# EasyEDA Pro project fm33fk5410_Topaz_v1.2.epro, board PCB7
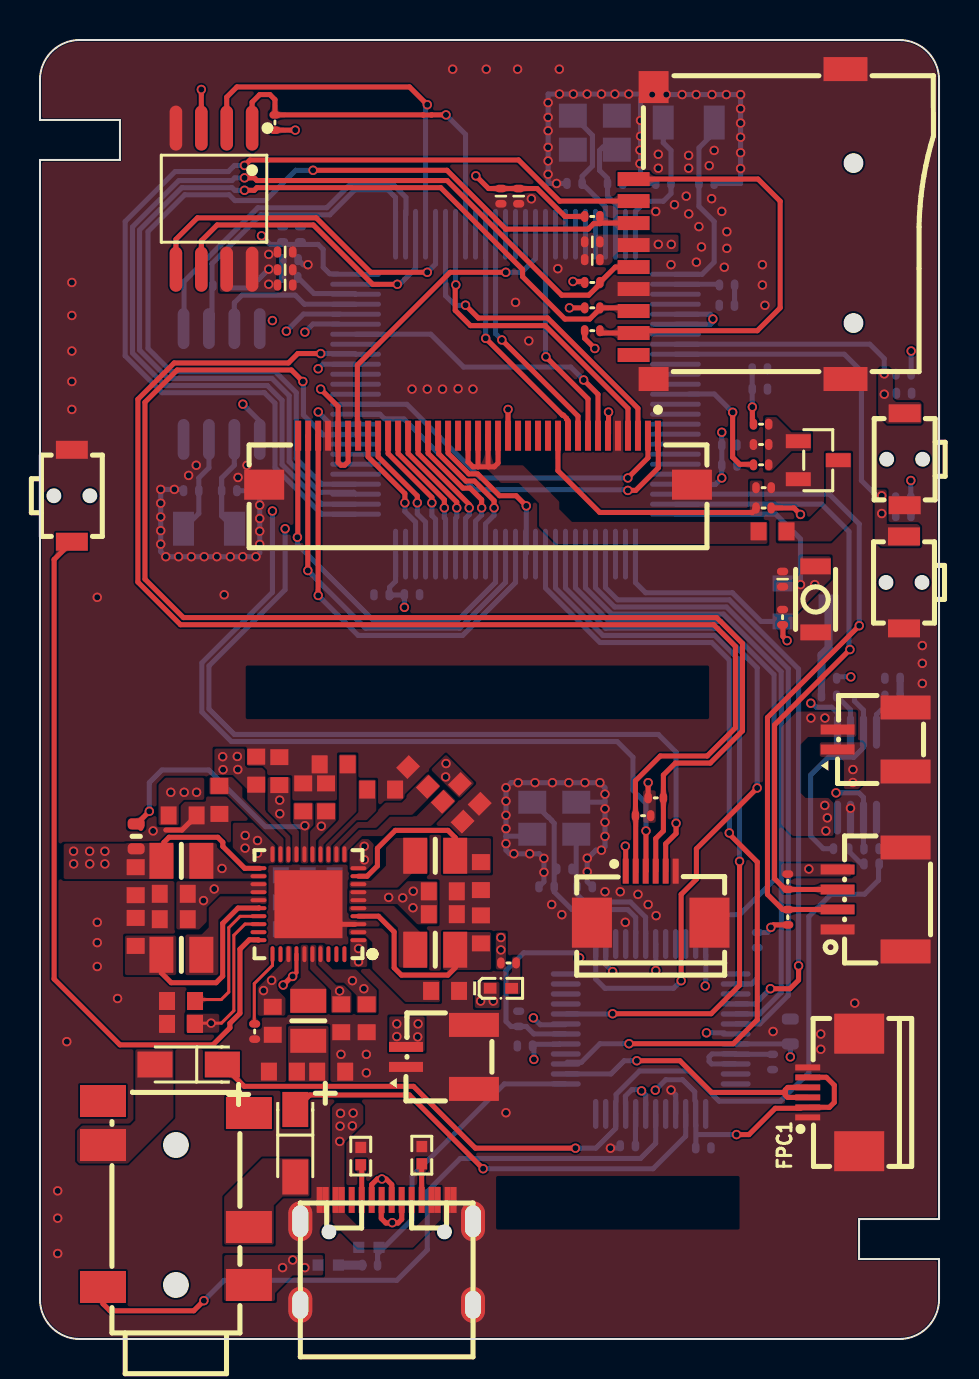
[diagram p3: board, top side]
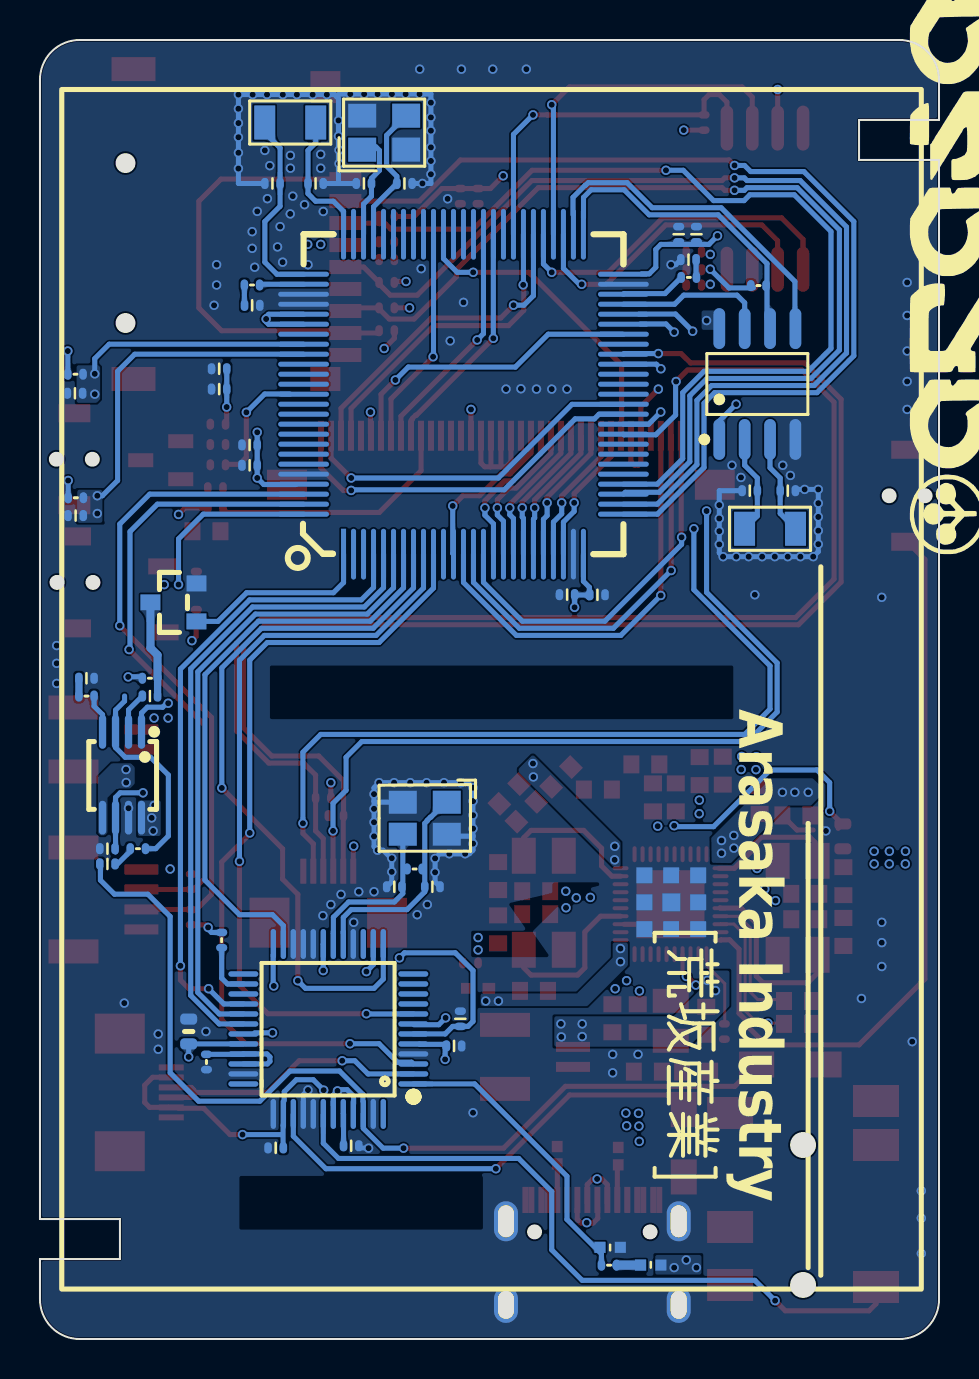
[diagram p4: board, bottom side, seen from below]

Outline 44.98 x 64.97 mm; copper layers: Top Layer, Inner1, Inner2, Bottom Layer. Coordinates in mm from the lower left corner of the outline.
Outline path: 0,62.99 0,60.97 4,60.97 4,58.97 0,58.97 0,1.99 arc(0.58,0.58) 1.99,0 42.99,0 arc(44.39,0.58) 44.98,1.99 44.98,4 40.98,4 40.98,6 44.98,6 44.98,62.99 arc(44.39,64.39) 42.99,64.97 1.99,64.97 arc(0.58,64.39) 0,62.99
Stack: Top Layer 0.035mm 外层铜厚1oz / Dielectric1 0.2104mm 7628 RC49% 8.6mil / Inner1 0.0152mm 内层铜厚 / Dielectric2 1.065mm 1.1mm H/HOZ Copper / Inner2 0.0152mm 内层铜厚 / Dielectric3 0.2104mm 7628 RC49% 8.6mil / Bottom Layer 0.035mm 外层铜厚1oz

## Design rules (mm)
template: 自定义配置
spacing copperThickness1oz (default): track to track 0.102, other pairs 0 to 0.3
spacing copperThickness2oz: track to track 0.203, other pairs 0.152 to 0.3
track width copperThickness1oz (default): min 0.127, default 0.254, max 2.54
track width copperThickness2oz: min 0.203, default 0.254, max 2.54
differential pair differentialPair (default): width min 0.127, default 0.254, max 2.54; gap min 0.152, default 0.152
via viaSize (default): diameter min 0.178, default 0.47, max 10; hole min 0.178, default 0.305, max 6.299

## Placement (name value [footprint] x y rotation side)
C4  12pF  [C0402-NSK]  26.74 57.8 180 bottom
C5  2.2uF  [C0603]  6.69 21 180 top
C6  22uF  [C0603]  22.06 20.49 90 top
C11  2.2uF  [C0603]  21.5 27.26 315 top
C12  2.2uF  [C0603]  20.65 26.37 315 top
C13  2.2uF  [C0603]  7.06 15.76 180 top
C14  2.2uF  [C0603]  7.06 16.91 180 top
C15  10uF  [C0603]  15.07 16.04 270 top
C16  10uF  [C0603]  16.34 16.04 270 top
C17  100nF  [C0603]  14.57 13.37 180 top
C18  22uF  [C0603]  12.15 13.38 0 top
C19  2.2uF  [C0603]  11.64 15.92 90 top
C20  1uF  [C0603]  20.26 17.41 180 top
C21  2.2uF  [C0603]  11.97 28.4 270 top
C22  2.2uF  [C0603]  10.82 28.43 270 top
C23  2.2uF  [C0603]  8.98 26.97 90 top
C24  2.2uF  [C0603]  13.17 27.09 270 top
C25  2.2uF  [C0603]  14.31 27.09 270 top
C26  4.7uF  [C0603]  17.07 27.48 180 top
C27  2.2uF  [C0603]  18.91 28.11 315 top
C28  2.2uF  [C0603]  14.69 28.74 0 top
C34  100nF  [C0402-NSK]  37.15 38.01 270 top
C35  1uF  [C0402-NSK]  34.36 51.7 0 bottom
C36  1uF  [C0402-NSK]  12.53 53.99 180 bottom
C342  100nF  [C0402-NSK]  13.02 55.26 270 bottom
C343  100nF  [C0402-NSK]  27.63 53.99 0 top
C346  100nF  [C0402-NSK]  24.26 14.66 0 bottom
C347  100nF  [C0402-NSK]  23.95 16.02 270 bottom
C348  1uf  [C0402-NSK]  29.41 9.67 180 bottom
C349  10nF  [C0402-NSK]  33.18 9.56 0 bottom
C350  12pF  [C0402-NSK]  25.34 22.62 0 bottom
C351  12pF  [C0402-NSK]  27.25 22.62 180 bottom
C352  10uF  [CAP-SMD_L3.2-W1.6-RD-C7171]  7.44 13.73 180 top
C353  10uF  [CAP-SMD_L3.2-W1.6-RD-C7171]  12.77 9.79 270 top
C358  100nF  [C0402-NSK]  41.6 23.76 180 bottom
C359  100nF  [C0402-NSK]  42.65 33.05 0 bottom
C360  1uF  [C0402-NSK]  39.47 32.16 180 bottom
C361  1uF  [C0402-NSK]  41.6 24.53 180 bottom
C367  100nF  [C0402-NSK]  12.26 54.37 180 top
C368  100nF  [C0402-NSK]  36.01 47.51 180 bottom
C369  100nF  [C0402-NSK]  34.49 44.72 180 bottom
C370  100nF  [C0402-NSK]  17.09 37.23 0 bottom
C371  100nF  [C0402-NSK]  18.61 37.23 180 bottom
C372  10uF  [C0402-NSK]  34.49 43.7 180 bottom
C373  100nF  [C0402-NSK]  36.01 48.53 180 bottom
C374  100nF  [C0402-NSK]  23.95 57.16 90 top
C375  100nF  [C0402-NSK]  12.14 55.26 270 bottom
C376  100nF  [C0402-NSK]  12.26 53.48 180 top
C377  100nF  [C0402-NSK]  12.26 52.72 180 top
C378  12pF  [C0402-NSK]  9.47 42.43 180 bottom
C379  12pF  [C0402-NSK]  7.56 42.43 0 bottom
C383  12pF  [C0402-NSK]  33.34 57.8 0 bottom
C384  12pF  [C0402-NSK]  31.19 57.8 180 bottom
C385  12pF  [C0402-NSK]  28.77 57.8 0 bottom
C391  22uF  [C0603]  4.79 22.9 270 top
C392  22uF  [C0603]  4.79 20.36 90 top
C393  22uF  [C0603]  22.06 23.16 270 top
C394  2.2uF  [C0603]  6.69 22.27 180 top
C395  2.2uF  [C0603]  7.14 26.19 0 top
C396  2.2uF  [C0603]  20.15 21.25 0 top
C397  2.2uF  [C0603]  20.15 22.39 0 top
C398  1uF  [C0603 NSK]  37.54 15.38 270 bottom
C400  10nF  [C0402-NSK#2]  16.45 4.59 0 bottom
C401  1uF  [C0402-NSK#2]  14.42 3.7 180 bottom
C402  1uF  [C0402-NSK]  43.22 47.3 180 bottom
C403  1uF  [C0402-NSK]  43.19 41.19 180 bottom
CARD2  TF-115-BCP9  [TF-SMD_TF-115-BCP9]  35 55.77 90 top
CN2  PJ-342  [AUDIO-SMD_PJ-342]  6.8 7.25 180 top
CN5  WAFER-SH1.0-4PWB  [CONN-SMD_4P-P1.00_WAFER-SH1.0-4PWB]  41.6 21.99 90 top
FPC1  FPC-05F-6PH20  [FPC-SMD_6P-P0.50_XUNPU_FPC-05F-6PH20]  39.69 12.33 90 top
L1  1uH  [L0806]  7.07 23.92 180 top
L2  1uH  [L0806]  7.07 19.22 180 top
L4  1uH  [L0806]  19.77 24.17 0 top
L5  1uH  [L0806]  13.42 15.92 90 top
L8  1uH  [L0806]  19.77 19.47 0 top
lcd1  KH-FG0.5-H2.0-37PIN  [FPC-SMD_37P-P0.50_KINGHELM_KH-FG0.5-H2.0-37PIN]  21.91 43.96 0 top
LED2  NCD0402R1  [LED0402-RD]  23.06 17.54 0 top
NOREF  -  [Pad_e74]  13.4 20.5 180 top
NOREF#2  -  [Pad_e87]  13.39 21.84 180 top
NOREF#3  -  [Pad_e101]  13.4 23.19 180 top
NOREF#4  -  [Pad_e73]  12.05 20.5 180 top
NOREF#5  -  [Pad_e90]  14.74 21.84 180 top
NOREF#6  -  [Pad_e75]  14.74 20.5 180 top
NOREF#7  -  [Pad_e88]  12.05 21.84 180 top
NOREF#8  -  [Pad_e106]  12.05 23.19 0 top
NOREF#9  -  [Pad_e91]  14.74 23.19 0 top
Q1  MMS8050-H-TP  [SOT-23-3_L2.9-W1.3-P1.90-LS2.4-BR]  38.93 43.96 180 top
Q5  AO3401A  [SOT-23_L2.9-W1.3-P1.90-LS2.4-BR]  38.3 36.84 180 bottom
R1  4.7kΩ  [R0402#2]  30.17 26.18 0 top
R2  4.7kΩ  [R0402#2]  30.8 27.07 180 top
R3  0Ω  [R0402#2]  36.2 42.58 0 top
R4  10KΩ  [R0402#2]  10.74 15.38 270 top
R5  4.33Ω  [C0603]  36.65 40.4 180 top
R6  1kΩ  [R0402#2]  36.07 43.73 0 top
R7  10kΩ  [R0402#2]  36.07 44.74 0 top
R8  NC  [R0402#2]  36.07 45.76 0 top
R18  10K  [R0402#2]  37.15 36.1 270 top
R19  47Ω  [R0402#2]  34.37 52.72 180 bottom
R20  47Ω  [R0402#2]  12.52 53.1 0 bottom
R21  4.7kΩ  [R0402#2]  37.41 22.87 90 top
R22  4.7kΩ  [R0402#2]  37.41 21.1 270 top
R23  4.7kΩ  [R0402#2]  27.63 50.43 180 top
R24  4.7kΩ  [R0402#2]  27.63 51.58 180 top
R25  4.7kΩ  [R0402#2]  27.63 52.85 180 top
R26  4.7kΩ  [R0402#2]  27.63 56.15 180 top
R27  100kΩ  [R0402#2]  35.88 19.95 90 bottom
R28  1MΩ  [R0402#2]  26.23 23.51 0 bottom
R29  100kΩ  [R0402#2]  36.65 13.86 90 bottom
R35  30kΩ  [R0402#2]  40.08 24.53 180 bottom
R36  30kΩ  [R0402#2]  42.65 32.16 180 bottom
R37  30kΩ  [R0402#2]  39.47 33.05 0 bottom
R42  10K  [R0402#2]  9.03 52.69 0 bottom
R50  10KΩ  [R0402#2]  23.44 18.81 0 top
R51  0Ω  [C0603 NSK]  4.81 25.14 270 top
R52  NC  [R0402#2]  36.2 41.57 0 top
R55  2kΩ  [R0402#2]  11.75 60.85 90 top
R56  5.1kΩ  [R0402]  19.1 9.19 270 top
R57  5.1kΩ  [R0402]  16.05 9.15 90 top
R58  430Ω  [R0402#2]  16.51 3.69 180 bottom
R59  4.7kΩ  [R0402#2]  43.18 42.08 0 bottom
R60  4.7kΩ  [R0402#2]  43.2 48.26 0 bottom
touch1  FPC-05F-6PH20  [FPC-SMD_6P-P0.50_XUNPU_FPC-05F-6PH20]  30.55 22.11 0 top
U2  FM33FK5X10  [LQFP100]  29.79 39.26 90 bottom
U6  TS2306A 200gf 002  [SW-SMD_L3.0-W2.0-LS3.5]  38.8 36.99 270 top
U10  THAF09-AC-R  [KEY-SMD_L3.9-W2.9-P4.6-LS5.0-W3.6-EH]  1.59 42.18 270 top
U11  10uF  [C0402-NSK]  27.63 54.88 0 top
U12  VS1053B-L  [LQFP-48_L7.0-W7.0-P0.50-LS9.0-BL]  30.55 15.51 90 bottom
U23  NS4150B  [MSOP-8_L3.0-W3.0-P0.65-LS5.0-BL]  40.87 28.22 0 bottom
U29  DS1302Z+T&R  [SOIC-8_L4.9-W3.9-P1.27-LS6.0-BL]  9.09 47.77 180 bottom
U32  10uF  [C0402-NSK]  23.06 57.16 90 top
U33  WAFER-SH1.0-2PWB  [CONN-SMD_2P-P1.00_XUNPU_WAFER-SH1.0-2PWB]  20.01 14.11 90 top
U34  AXP2101&TG28  [QFN-40_L5.0-W5.0-P0.40-TL-EP3.4]  13.43 21.75 180 top
U35  W25Q128JVSIQ  [SOIC-8_L5.3-W5.3-P1.27-LS8.0-BL]  8.71 57.04 180 top
U36  WAFER-SH1.0-2PWB  [CONN-SMD_2P-P1.00_XUNPU_WAFER-SH1.0-2PWB]  41.6 29.99 90 top
U37  THAF09-AC-R  [KEY-SMD_L3.9-W2.9-P4.6-LS5.0-W3.6-EH]  43.22 37.84 90 top
U38  THAF09-AC-R  [KEY-SMD_L3.9-W2.9-P4.6-LS5.0-W3.6-EH]  43.26 44 90 top
USBC1  HOST  [USB-TYPE-C_16PIN-MALE-TYPE-C-31-M-12]  17.34 4.33 0 top
X1  32.768kHz  [OSC-SMD_L3.2-W1.5]  32.46 60.85 180 bottom
X2  8MHz  [CRYSTAL-SMD_4P-L3.2-W2.5-BL]  27.76 60.34 180 bottom
X3  12.288MHz  [CRYSTAL-SMD_4P-L3.2-W2.5-BL-2]  25.72 26.05 0 bottom
X4  32.768kHz  [OSC-SMD_L3.2-W1.5]  8.45 40.53 0 bottom

## Footprints (pads in the part's own frame, mm; a bottom-side part is the same pattern mirrored in y, then rotated)
AUDIO-SMD_PJ-342
  rect 2.3x1.6 smd: 2(-3.65,4.55) 3(3.65,4.65) 4(-3.65,1.65) 5(3.65,-2.45) 6(-3.65,-4.05) 7(3.65,-4.65)
C0402-NSK
  rrect 0.381x0.559 smd: 1(-0.381,0) 2(0.381,0)
C0402-NSK#2
  rect 0.559x0.559 smd: 1(-0.508,0) 2(0.508,0)
C0603
  rect 0.8x0.9 smd: 1(-0.7,0) 2(0.7,0)
C0603 NSK
  rrect 0.559x0.85 smd: 1(-0.623,0) 2(0.623,0)
CAP-SMD_L3.2-W1.6-RD-C7171
  rect 1.758x1.296 smd: 1(-1.687,0) 2(1.687,0)
CONN-SMD_2P-P1.00_XUNPU_WAFER-SH1.0-2PWB
  rect 0.5x1.7 smd: 1(-0.5,1.7) 2(0.5,1.7)
  rect 1.2x2.5 smd: 3(1.6,-1.7) 4(-1.6,-1.7)
CONN-SMD_4P-P1.00_WAFER-SH1.0-4PWB
  rect 0.5x1.7 smd: 1(-1.5,1.7) 2(-0.5,1.7) 3(0.5,1.7) 4(1.5,1.7)
  rect 1.2x2.5 smd: 5(-2.6,-1.7) 6(2.6,-1.7)
CRYSTAL-SMD_4P-L3.2-W2.5-BL
  rect 1.4x1.2 smd: 1(-1.1,-0.85) 2(1.1,-0.85) 3(1.1,0.85) 4(-1.1,0.85)
CRYSTAL-SMD_4P-L3.2-W2.5-BL-2
  rect 1.4x1.15 smd: 1(-1.1,-0.8) 2(1.1,-0.8) 3(1.1,0.8) 4(-1.1,0.8)
FPC-SMD_6P-P0.50_XUNPU_FPC-05F-6PH20
  rect 0.3x1.25 smd: 1(-1.25,1.288) 2(-0.75,1.288) 3(-0.25,1.288) 4(0.25,1.288) 5(0.75,1.288) 6(1.25,1.288)
  rect 2x2.5 smd: 7(2.94,-1.288) 8(-2.94,-1.288)
FPC-SMD_37P-P0.50_KINGHELM_KH-FG0.5-H2.0-37PIN
  rect 0.3x1.5 smd: 1(9,1.225) 2(8.5,1.225) 3(8,1.225) 4(7.5,1.225) 5(7,1.225) 6(6.5,1.225) 7(6,1.225) 8(5.5,1.225) 9(5,1.225) 10(4.5,1.225) 11(4,1.225) 12(3.5,1.225) 13(3,1.225) 14(2.5,1.225) 15(2,1.225) 16(1.5,1.225) 17(1,1.225) 18(0.5,1.225) 19(0,1.225) 20(-0.5,1.225) 21(-1,1.225) 22(-1.5,1.225) 23(-2,1.225) 24(-2.5,1.225) 25(-3,1.225) 26(-3.5,1.225) 27(-4,1.225) 28(-4.5,1.225) 29(-5,1.225) 30(-5.5,1.225) 31(-6,1.225) 32(-6.5,1.225) 33(-7,1.225) 34(-7.5,1.225) 35(-8,1.225) 36(-8.5,1.225) 37(-9,1.225)
  rect 2x1.5 smd: 38(-10.7,-1.225) 39(10.7,-1.225)
KEY-SMD_L3.9-W2.9-P4.6-LS5.0-W3.6-EH
  rect 0.9x1.6 smd: 1(-2.3,0) 2(2.3,0)
L0806
  rect 1.2x1.8 smd: 1(-1,0) 2(1,0)
LED0402-RD
  rect 0.636x0.54 smd: 1(-0.538,0) 2(0.538,0)
LQFP100
  rect 2.54x0.25 smd: 1(0,0)
  oval 2.54x0.25 smd: 2(0,-0.5) 3(0,-1) 4(0,-1.5) 5(0,-2) 6(0,-2.5) 7(0,-3) 8(0,-3.5) 9(0,-4) 10(0,-4.5) 11(0,-5) 12(0,-5.5) 13(0,-6) 14(0,-6.5) 15(0,-7) 16(0,-7.5) 17(0,-8) 18(0,-8.5) 19(0,-9) 20(0,-9.5) 21(0,-10) 22(0,-10.5) 23(0,-11) 24(0,-11.5) 25(0,-12) 51(16,-12) 52(16,-11.5) 53(16,-11) 54(16,-10.5) 55(16,-10) 56(16,-9.5) 57(16,-9) 58(16,-8.5) 59(16,-8) 60(16,-7.5) 61(16,-7) 62(16,-6.5) 63(16,-6) 64(16,-5.5) 65(16,-5) 66(16,-4.5) 67(16,-4) 68(16,-3.5) 69(16,-3) 70(16,-2.5) 71(16,-2) 72(16,-1.5) 73(16,-1) 74(16,-0.5) 75(16,0)
  oval 0.25x2.54 smd: 26(2,-14) 27(2.5,-14) 28(3,-14) 29(3.5,-14) 30(4,-14) 31(4.5,-14) 32(5,-14) 33(5.5,-14) 34(6,-14) 35(6.5,-14) 36(7,-14) 37(7.5,-14) 38(8,-14) 39(8.5,-14) 40(9,-14) 41(9.5,-14) 42(10,-14) 43(10.5,-14) 44(11,-14) 45(11.5,-14) 46(12,-14) 47(12.5,-14) 48(13,-14) 49(13.5,-14) 50(14,-14) 76(14,2) 77(13.5,2) 78(13,2) 79(12.5,2) 80(12,2) 81(11.5,2) 82(11,2) 83(10.5,2) 84(10,2) 85(9.5,2) 86(9,2) 87(8.5,2) 88(8,2) 89(7.5,2) 90(7,2) 91(6.5,2) 92(6,2) 93(5.5,2) 94(5,2) 95(4.5,2) 96(4,2) 97(3.5,2) 98(3,2) 99(2.5,2) 100(2,2)
LQFP-48_L7.0-W7.0-P0.50-LS9.0-BL
  oval 0.27x1.5 smd: 1(-2.75,-4.25) 2(-2.25,-4.25) 3(-1.75,-4.25) 4(-1.25,-4.25) 5(-0.75,-4.25) 6(-0.25,-4.25) 7(0.25,-4.25) 8(0.75,-4.25) 9(1.25,-4.25) 10(1.75,-4.25) 11(2.25,-4.25) 12(2.75,-4.25) 25(2.75,4.25) 26(2.25,4.25) 27(1.75,4.25) 28(1.25,4.25) 29(0.75,4.25) 30(0.25,4.25) 31(-0.25,4.25) 32(-0.75,4.25) 33(-1.25,4.25) 34(-1.75,4.25) 35(-2.25,4.25) 36(-2.75,4.25)
  oval 1.5x0.27 smd: 13(4.25,-2.75) 14(4.25,-2.25) 15(4.25,-1.75) 16(4.25,-1.25) 17(4.25,-0.75) 18(4.25,-0.25) 19(4.25,0.25) 20(4.25,0.75) 21(4.25,1.25) 22(4.25,1.75) 23(4.25,2.25) 24(4.25,2.75) 37(-4.25,2.75) 38(-4.25,2.25) 39(-4.25,1.75) 40(-4.25,1.25) 41(-4.25,0.75) 42(-4.25,0.25) 43(-4.25,-0.25) 44(-4.25,-0.75) 45(-4.25,-1.25) 46(-4.25,-1.75) 47(-4.25,-2.25) 48(-4.25,-2.75)
MSOP-8_L3.0-W3.0-P0.65-LS5.0-BL
  oval 0.364x1.692 smd: 1(-0.975,-2.146) 2(-0.325,-2.146) 3(0.325,-2.146) 4(0.975,-2.146) 5(0.975,2.146) 6(0.325,2.146) 7(-0.325,2.146) 8(-0.975,2.146)
OSC-SMD_L3.2-W1.5
  rect 1.05x1.7 smd: 1(-1.275,0) 2(1.275,0)
Pad_e73
  rect 0.8x0.8 smd far side: 31(0,0)
Pad_e74
  rect 0.8x0.8 smd far side: 31(0,0)
Pad_e75
  rect 0.8x0.8 smd far side: 31(0,0)
Pad_e87
  rect 0.9x0.9 smd far side: 31(0,0)
Pad_e88
  rect 0.8x0.8 smd far side: 31(0,0)
Pad_e90
  rect 0.8x0.8 smd far side: 31(0,0)
Pad_e91
  rect 0.8x0.8 smd far side: 31(0,0)
Pad_e101
  rect 0.8x0.8 smd far side: 31(0,0)
Pad_e106
  rect 0.8x0.8 smd far side: 31(0,0)
QFN-40_L5.0-W5.0-P0.40-TL-EP3.4
  oval 0.8x0.2 smd: 1(-2.499,1.8) 2(-2.499,1.4) 3(-2.499,1) 4(-2.499,0.6) 5(-2.499,0.2) 6(-2.499,-0.2) 7(-2.499,-0.6) 8(-2.499,-1) 9(-2.499,-1.4) 10(-2.499,-1.8) 21(2.499,-1.8) 22(2.499,-1.4) 23(2.499,-1) 24(2.499,-0.6) 25(2.499,-0.2) 26(2.499,0.2) 27(2.499,0.6) 28(2.499,1) 29(2.499,1.4) 30(2.499,1.8)
  oval 0.2x0.8 smd: 11(-1.8,-2.499) 12(-1.4,-2.499) 13(-1,-2.499) 14(-0.6,-2.499) 15(-0.2,-2.499) 16(0.2,-2.499) 17(0.6,-2.499) 18(1,-2.499) 19(1.4,-2.499) 20(1.8,-2.499) 31(1.8,2.499) 32(1.4,2.499) 33(1,2.499) 34(0.6,2.499) 35(0.2,2.499) 36(-0.2,2.499) 37(-0.6,2.499) 38(-1,2.499) 39(-1.4,2.499) 40(-1.8,2.499)
  rect 3.4x3.4 smd: 41(0,0)
R0402
  rect 0.566x0.54 smd: 1(-0.433,0) 2(0.433,0)
R0402#2
  rrect 0.381x0.559 smd: 1(-0.381,0) 2(0.381,0)
SOIC-8_L4.9-W3.9-P1.27-LS6.0-BL
  oval 0.588x2.045 smd: 1(-1.905,-2.772) 2(-0.635,-2.772) 3(0.635,-2.772) 4(1.905,-2.772) 5(1.905,2.772) 6(0.635,2.772) 7(-0.635,2.772) 8(-1.905,2.772)
SOIC-8_L5.3-W5.3-P1.27-LS8.0-BL
  oval 0.63x2.25 smd: 1(-1.905,-3.53) 2(-0.635,-3.53) 3(0.635,-3.53) 4(1.905,-3.53) 5(1.905,3.53) 6(0.635,3.53) 7(-0.635,3.53) 8(-1.905,3.53)
SOT-23-3_L2.9-W1.3-P1.90-LS2.4-BR
  rect 1.25x0.7 smd: 1(1,-0.95) 2(1,0.95) 3(-1,0)
SOT-23_L2.9-W1.3-P1.90-LS2.4-BR
  rect 1x0.8 smd: 1(1.15,-0.95) 2(1.15,0.95) 3(-1.15,0)
SW-SMD_L3.0-W2.0-LS3.5
  rect 0.8x1.524 smd: 1(-1.651,0) 2(1.651,0)
TF-SMD_TF-115-BCP9
  rect 0.7x1.6 smd: 1(2.25,5.3) 2(1.15,5.3) 3(0.05,5.3) 4(-1.05,5.3) 5(-2.15,5.3) 6(-3.25,5.3) 7(-4.35,5.3) 8(-5.45,5.3) 9(-6.55,5.3)
  rect 1.2x1.5 smd: 10(-7.75,4.3)
  rect 1.2x2.2 smd: 11(-7.75,-5.3) 13(7.75,-5.3)
  rect 1.6x1.5 smd: 12(6.85,4.3)
USB-TYPE-C_16PIN-MALE-TYPE-C-31-M-12
  oval 1.2x2 hole 0.8x1.6: 0(-4.32,1.556) 0(4.32,1.556)
  oval 1.2x1.8 hole 0.8x1.4: 0(-4.32,-2.624) 0(4.32,-2.624)
  rect 0.3x1.3 smd: A1(-3.35,2.623) A4(-2.55,2.623) A5(-1.25,2.623) A6(-0.25,2.623) A7(0.25,2.623) A8(1.25,2.624) A9(2.55,2.623) A12(3.35,2.623) B1(3.05,2.623) B4(2.25,2.623) B5(1.75,2.623) B6(0.75,2.623) B7(-0.75,2.623) B8(-1.75,2.624) B9(-2.25,2.623) B12(-3.05,2.623)

## Nets
As in the schematic, except:
GND: C4.2 C5.2 C6.2 C11.2 C12.2 C13.2 C14.2 C15.2 C16.2 C17.1 C18.1 C19.1 C20.1 C21.1 C22.1 C23.1 C24.1 C25.1 C26.1 C27.1 C28.1 C34.1 C35.1 C36.1 C342.1 C343.1 C346.1 C347.1 C348.2 C349.2 C350.1 C351.1 C359.1 C361.1 C367.1 C368.1 C369.1 C370.1 C371.1 C372.1 C373.1 C374.1 C375.1 C376.1 C377.1 C378.1 C379.1 C383.2 C384.2 C385.2 C391.2 C392.2 C393.2 C394.2 C395.2 C396.2 C397.2 C398.1 C400.1 C402.1 C403.1 CARD2.6 CARD2.10 CARD2.11 CARD2.12 CARD2.13 CN5.1 CN5.5 CN5.6 FPC1.1 FPC1.6 FPC1.7 FPC1.8 lcd1.5 lcd1.34 lcd1.38 lcd1.39 NOREF.31 NOREF#2.31 NOREF#3.31 NOREF#4.31 NOREF#5.31 NOREF#6.31 NOREF#7.31 NOREF#8.31 NOREF#9.31 Q1.2 Q5.2 R3.2 R4.2 R7.1 R29.1 R56.1 R57.2 touch1.6 touch1.7 touch1.8 U2.24 U2.49 U2.78 U2.79 U2.96 U6.2 U10.1 U11.1 U12.4 U12.16 U12.20 U12.21 U12.22 U12.35 U12.37 U12.40 U12.41 U12.47 U23.7 U29.4 U32.1 U33.1 U33.3 U33.4 U34.3 U34.41 U35.4 U36.3 U36.4 U37.1 U38.1 USBC1.0 USBC1.A1 USBC1.A12 USBC1.B1 USBC1.B12 X2.2 X2.4 X3.2 X3.4
DCDC1: C342.2 C343.2 C347.2 C367.2 C368.2 C369.2 C370.2 C371.2 C372.2 C373.2 C374.2 C375.2 C376.2 C377.2 C391.1 C398.2 CARD2.4 CN5.4 L1.2 lcd1.6 lcd1.16 lcd1.32 lcd1.33 R1.2 R2.2 R8.1 R18.2 R21.2 R22.2 R23.2 R24.2 R25.2 R26.2 R27.2 R37.2 R42.2 R51.2 R52.2 R55.1 R59.2 R60.2 touch1.1 U2.25 U2.50 U2.80 U2.81 U2.97 U11.2 U12.6 U12.14 U12.19 U12.32 U23.1 U29.1 U32.2 U34.21 U35.3 U35.7 U35.8
$3N2311: C360.2 Q5.3 R37.1

Pads without a net: CARD2 9; CN2 6 7; lcd1 21; U2 82; U12 9 10 11 12 15 25 27 36 48; USBC1 A8 B8

## Via types
v1: diameter 0.47, hole 0.305, Top Layer to Bottom Layer, 319 vias

## Routing (per net, layer and track width the routed paths; a pad name or vN(x,y) marks a point on that pad's centre or on a via; arc(x,y) is an arc through that point)
GND: length 66.1
  Top Layer w0.254: 6.29,25.46 7.11,25.46 C395.2 ; 15.75,20.74 14.76,20.74 14.75,20.75
  Bottom Layer w0.254: 28.26,26.9 v1(28.26,27.25) 28.26,27.57 v1(28.01,27.83) v1(27.26,27.83) v1(26.45,27.83) v1(25.63,27.83) v1(24.76,27.83) v1(23.92,27.83) 23.57,27.83 v1(23.31,27.57) v1(23.31,26.91) v1(23.31,26.2) v1(23.31,25.53) 23.31,25.15 ; 28.26,26.9 28.21,26.85 X3.2 ; 28.26,26.9 v1(28.26,26.52) v1(28.26,25.85) v1(28.26,25.14) 28.26,24.63 v1(28.09,24.45) 27.81,24.45 27.41,24.05 v1(27.38,24.05) v1(27.38,23.37) 27.38,22.87 C351.1 ; v1(31.57,12.45) 31.8,12.22 31.8,11.26 ; C384.2 30.04,57.8 ; 30.04,57.8 C385.2 ; 30.04,57.8 v1(30.04,60.16) v1(30.04,60.95) 30.04,62.05 30.13,62.13 ; v1(13.41,53.74) 13.17,53.74 C36.1 ; 28.95,9.56 28.55,9.56 v1(28.54,9.55) ; 30.13,62.13 29.99,62.27 v1(29.45,62.27) v1(28.76,62.27) v1(28.09,62.27) v1(27.37,62.27) v1(26.68,62.27) v1(25.99,62.27) 25.42,62.27 v1(25.42,61.84) v1(25.42,61.1) v1(25.42,60.44) v1(25.42,59.6) v1(25.42,58.92) v1(25.42,58.26) 25.42,57.8 v1(25.84,57.8) C4.2 ; 30.13,62.13 30.24,62.24 v1(30.62,62.24) v1(31.33,62.24) v1(32.12,62.24) v1(32.83,62.24) v1(33.62,62.24) v1(34.34,62.24) v1(35.05,62.24) v1(35.05,61.54) v1(35.05,60.82) v1(35.05,60.11) v1(35.05,59.33) v1(35.05,58.54) 35.05,57.8 C383.2 ; C350.1 25.21,22.87 v1(25.21,23.35) v1(25.21,24.04) 24.98,24.27 v1(24.5,24.27) 23.49,24.27 23.31,24.45 v1(23.31,24.78) 23.31,25.15 ; 23.31,25.15 24.52,25.15 X3.4 ; C379.1 7.12,42.5 v1(6.72,42.5) v1(6.04,42.5) v1(6.04,41.81) v1(6.04,41.12) v1(6.04,40.43) v1(6.04,39.76) 6.04,39.38 v1(6.29,39.13) v1(6.93,39.13) v1(7.57,39.13) v1(8.22,39.13) v1(8.85,39.13) v1(9.52,39.13) v1(10.14,39.13) v1(10.8,39.13) 10.99,39.32 v1(10.99,39.75) v1(10.99,40.41) v1(10.99,41.04) v1(10.99,41.71) 10.99,42.43 C378.1
  vias: v1(0.89,7.41) v1(0.89,6.04) v1(0.89,4.28) v1(1.34,14.87) v1(1.59,52.85) v1(1.59,51.2) v1(1.59,49.42) v1(1.59,47.89) v1(1.59,46.5) v1(2.86,37.1) v1(2.86,20.84) v1(2.86,19.83) v1(2.86,18.63) v1(3.88,17.03) v1(5.66,25.41) v1(7.44,43.19) v1(7.82,43.7) v1(9.21,37.23) v1(9.91,43.09) v1(10.36,43.7) v1(15.06,14.24) v1(16.33,14.24) v1(16.33,13.31) v1(18.61,47.51) v1(19.37,47.51) v1(20.14,47.51) v1(20.64,63.51) v1(20.92,47.53) v1(21.66,47.51) v1(22.33,63.51) v1(23.31,11.32) v1(23.71,24.27) v1(23.79,51.85) v1(23.89,63.51) v1(24.45,49.93) v1(24.58,57.03) v1(25.6,21.73) v1(25.91,53.54) v1(25.98,63.51) v1(26.11,21.22) v1(28.26,22.37) v1(29.03,22.37) v1(29.28,20.84) v1(29.92,22.24) v1(30.01,59.47) v1(30.01,58.79) v1(30.42,21.73) v1(30.8,56.4) v1(30.82,21.18) v1(30.93,59.26) v1(30.93,58.56) v1(31.57,53.74) v1(31.74,56.74) v1(32.33,57.16) v1(32.45,59.2) v1(32.45,58.56) v1(32.46,56.28) v1(32.84,53.86) v1(32.96,55.64) v1(33.09,54.62) v1(33.48,58.69) v1(33.6,57.04) v1(33.73,59.45) v1(34.11,56.4) v1(34.23,53.61) v1(34.36,55.39) v1(34.36,54.55) v1(36.14,53.74) v1(36.14,52.72) v1(36.27,51.7) v1(36.67,15.38) v1(39.06,15.25) v1(39.06,14.49) v1(40.55,26.55) v1(40.76,16.8) v1(44.14,34.69) v1(44.14,33.8) v1(44.14,32.79)
VBAT: length 4.2
  Bottom Layer w0.254: v1(39.82,27.32) 40.96,27.32 41.2,27.09 U23.6 41.2,24.36
  vias: v1(11.18,17.43) v1(11.59,17.94) v1(17.85,15.76) v1(17.85,15.13) v1(18.92,15.76) v1(18.9,15.11)
VBUS:
  vias: v1(15.03,11.29) v1(15.01,10.65) v1(15,9.88) v1(15.63,17.92) v1(15.63,10.66) v1(15.67,11.3) v1(16.2,17.52)
ALDO1: length 6.2
  Bottom Layer w0.254: v1(24.68,16.06) 25.03,15.72 26.27,15.72 ; 34.23,15.32 v1(33.34,15.32) ; v1(24.71,13.98) 24.71,14.59 C346.2 ; 26,14.76 25.97,14.74 24.76,14.74 24.74,14.76 ; 33.31,19.21 33.31,17.69 v1(33.28,17.66)
  vias: v1(9.14,29.13) v1(9.16,28.48) v1(9.87,29.14) v1(9.9,28.48)
ALDO3: length 26.8
  Top Layer w0.254: 38.06,11.54 36.78,11.54 35.47,10.23 v1(34.84,10.23) ; v1(30.78,12.45) 30.78,12.39 ; 38.51,11.58 38.52,11.59 39.49,11.59 39.74,11.83 39.74,12.7 39.34,13.09 38.98,13.09 ; v1(5.47,26.4) 5.04,25.97 5.04,25.54
  Bottom Layer w0.254: 32.81,10.71 32.81,9.69 32.76,9.63 ; 30.29,11.69 30.3,11.7 30.3,12.2 30.03,12.47 29.61,12.47 29.28,12.15 29.28,11.77 ; 32.87,10.23 v1(34.84,10.23) 34.92,10.23 34.92,10.23 ; 32.75,11.92 32.75,12.37 32.15,12.97 31.3,12.97 v1(30.78,12.45) ; 13.28,25.63 11.28,25.63 8.44,28.46 6.1,28.46 5.47,27.83 v1(5.47,26.4)
  vias: v1(13.25,25.67) v1(30.09,12.41)
ALDO4:
  vias: v1(14.07,25.65)
AUDIO_KEY: length 9.6
  Bottom Layer w0.254: U2.1 29.79,37.83 30.3,37.33 34.64,37.33 36.07,35.89 37.15,35.89
BL: length 6
  Top Layer w0.254: v1(34.65,46.35) 34.65,44.1 35,43.75 35.71,43.75
  Bottom Layer w0.254: v1(34.65,46.35) 33.74,47.27 32.47,47.27
CE: length 16.3
  Bottom Layer w0.254: 7.18,50.92 7.21,50.95 7.21,52.89 10.9,56.59 14.35,56.59 15.6,57.84 17.55,57.84 17.68,57.71 17.7,57.71 18.31,57.1 18.31,56.23
CHGLED:
  vias: v1(15.94,19.53) v1(15.94,18.87) v1(22.04,16.91) v1(22.68,16.91)
CLK: length 51.6
  Top Layer w0.254: R25.1 28.78,53.62 CARD2.5 ; 28.04,52.8 27.45,52.21 26.1,52.21 20.37,57.94 10.85,57.94 10.72,58.08 v1(10.23,58.08)
  Bottom Layer w0.254: U2.27 14.09,41.76 12.11,43.74 12.11,46.95 11.37,47.69 6.25,47.69 4.63,49.32 4.63,55.62 6.95,57.94 9.61,57.94 9.74,58.08 v1(10.23,58.08)
CPUS_LDO:
  vias: v1(16.22,24.64) v1(16.23,23.97) v1(20.31,28.78) v1(20.29,28.11)
CS: length 51
  Top Layer w0.254: CARD2.2 26,56.92 23.94,58.97 10.5,58.97 v1(10.23,58.7)
  Bottom Layer w0.254: v1(10.23,58.7) 9.73,58.7 9.42,58.39 6.76,58.39 4.26,55.89 4.26,49.18 6.11,47.33 11.23,47.33 11.75,46.81 11.75,43.59 14.09,41.26 U2.26
DB0: length 18.8
  Top Layer w0.254: lcd1.1 30.93,45.16 30.93,43.58 29.8,42.44 v1(29.41,42.44)
  Bottom Layer w0.254: v1(29.41,42.44) 29.38,42.48 21.75,42.48 18.2,46.02 17.24,46.02 17.01,46.26 U2.36
DB1: length 17.7
  Top Layer w0.254: lcd1.2 30.41,44.07 v1(29.41,43.07)
  Bottom Layer w0.254: v1(29.41,43.07) 22.04,43.07 18.36,46.75 15.8,46.75 U2.37
DB2: length 16.4
  Top Layer w0.254: lcd1.3 29.91,46.55 25.4,51.07 21.93,51.07 v1(21.29,51.71)
  Bottom Layer w0.254: U2.56 20.29,52.19 20.77,51.71 v1(21.29,51.71)
DB3: length 15.9
  Top Layer w0.254: lcd1.4 29.41,46.55 25.27,50.69 21.53,50.69 20.77,51.45 20.77,52.69 v1(20.8,52.73)
  Bottom Layer w0.254: v1(20.8,52.73) 20.79,52.74 U2.57
DB4: length 8.3
  Top Layer w0.254: v1(24.33,41.67) 23.82,42.18 22.99,42.18 21.9,43.27 21.45,43.27 20.41,44.31 lcd1.22
  Bottom Layer w0.254: U2.12 24.33,39.3 v1(24.33,41.67)
DB5: length 21.2
  Top Layer w0.254: 13.91,45.18 13.91,37.2 v1(13.92,37.19)
  Bottom Layer w0.254: U2.13 23.79,37.84 21.14,35.19 15.92,35.19 v1(13.92,37.19)
DB6: length 20.2
  Top Layer w0.254: v1(13.4,38.44) 13.4,45.15 13.39,45.16 lcd1.36
  Bottom Layer w0.254: v1(13.4,38.44) 16.29,35.55 21,35.55 23.29,37.84 U2.14
DB7: length 19.2
  Top Layer w0.254: lcd1.37 12.9,45.16 12.9,40.12 v1(12.88,40.1)
  Bottom Layer w0.254: U2.15 22.79,37.85 20.85,35.9 16.72,35.9 12.88,39.74 v1(12.88,40.1)
DB8: length 7.5
  Top Layer w0.254: v1(22.72,41.57) 22.72,41.93 21.73,42.91 21.31,42.91 19.95,44.27 19.95,45.15 lcd1.23
  Bottom Layer w0.254: U2.16 22.29,40.77 22.72,41.2 v1(22.72,41.57)
DB9: length 7.4
  Top Layer w0.254: v1(22.09,41.57) 22.09,41.98 21.52,42.56 21.16,42.56 19.41,44.3 lcd1.24
  Bottom Layer w0.254: U2.17 21.79,40.91 22.09,41.22 v1(22.09,41.57)
DB10: length 7.1
  Top Layer w0.254: lcd1.25 18.91,44.3 21.47,41.74 v1(21.47,41.57)
  Bottom Layer w0.254: U2.18 21.29,41.04 21.47,41.23 v1(21.47,41.57)
DB11: length 7
  Top Layer w0.254: v1(20.85,41.57) 20.85,41.86 18.41,44.3 lcd1.26
  Bottom Layer w0.254: v1(20.85,41.57) 20.85,41.11 20.79,41.05 U2.19
DB12: length 6.9
  Top Layer w0.254: v1(20.23,41.57) 20.23,41.98 17.91,44.29 lcd1.27
  Bottom Layer w0.254: U2.20 20.29,41.01 20.23,41.07 v1(20.23,41.57)
DB13: length 6.9
  Top Layer w0.254: v1(19.61,41.83) 19.61,42.1 17.41,44.29 lcd1.28
  Bottom Layer w0.254: v1(19.61,41.83) 19.61,41.19 19.79,41 U2.21
DB14: length 6.9
  Top Layer w0.254: v1(18.88,41.83) 18.88,42.17 16.91,44.13 lcd1.29
  Bottom Layer w0.254: v1(18.88,41.83) 18.88,41.28 19.29,40.86 U2.22
DB15: length 6.9
  Top Layer w0.254: v1(18.25,41.83) 18.25,42.29 16.41,44.13 lcd1.30
  Bottom Layer w0.254: v1(18.25,41.83) 18.25,41.4 18.79,40.86 U2.23
DC1SW:
  vias: v1(6.54,27.35) v1(7.21,27.35) v1(7.83,27.35) v1(10.27,25.19) v1(10.26,24.55) v1(10.88,24.93) v1(10.88,24.3)
DCDC1: length 77.8
  Top Layer w0.254: U35.3 v1(8.07,62.5) ; 6.24,24.44 6.2,24.48 6.2,24.84 6.46,25.1 8.89,25.1 9.15,24.84 9.15,24.64 10.24,23.54 11,23.54 ; R23.2 27.25,50.05 v1(27.76,49.54) ; v1(36.56,20.59) 36.69,20.72 R22.2 ; R55.1 v1(12.77,60.47) ; 35.64,45.92 v1(35.64,46.62) ; R24.2 v1(26.49,51.58) ; lcd1.32 15.41,43.88 15.24,43.7 15.06,43.7 14.91,43.84 lcd1.33 14.91,46.64 v1(14.04,47.51) ; R25.2 27.2,52.9 v1(26.66,52.9) ; 37.17,35.78 37.17,35.14 v1(37.37,34.93) ; R26.2 26.26,56.15 24.87,57.55 22.44,57.55 v1(21.8,58.18) ; touch1.1 29.3,24.63 v1(29.28,24.65) ; R2.2 v1(30.42,27.83) ; v1(38.04,41.24) 37.72,41.57 R52.2 ; 28.44,45.28 v1(28.44,46.36) ; lcd1.16 v1(23.41,46.5)
  Bottom Layer w0.254: v1(28.65,18.38) 28.3,18.72 U12.14 ; 37.54,14.89 37.47,14.82 ; v1(11.08,55.18) 11.51,54.75 13.91,54.75 14.17,54.5 14.17,53.61 14.5,53.28 14.88,53.28 ; U2.80 33.54,51.26 33.66,51.13 33.66,50.88 33.54,50.76 U2.81 ; 18.23,37.08 18.09,37.21 17.65,37.21 17.52,37.08 ; 18.23,37.08 v1(18.23,36.6) ; 18.23,37.08 18.23,37.23 C371.2 ; R59.2 v1(43.56,42.94) ; U12.19 30.8,19.75 v1(30.8,18.43) ; 17.49,37.13 17.49,37.6 17.79,37.9 U2.25 ; 9.29,52.57 10.51,52.57 v1(11.44,53.51) ; v1(35.64,46.62) 35.63,46.62 C368.2 C373.2 ; v1(34.11,45.35) C369.2 C372.2 v1(34.11,43.07) 33.78,42.74 32.17,42.74 ; C398.2 v1(37.54,14.11) ; R27.2 36.39,20.33 36.65,20.59 ; R60.2 v1(43.58,49.42) ; U12.6 24.7,15.26 24.33,15.64 C347.2 23.57,15.64 23.31,15.89 23.31,18.43 24.2,19.32 26.74,19.32 v1(26.99,19.06) ; 37.41,14.76 U12.32 ; v1(38.56,31.8) 38.64,31.8 38.84,31.6 39.6,31.6 39.9,31.31 U23.1 ; 39.82,33.12 40.56,33.12 v1(40.56,33.12) ; 11,45.66 11,45.91 v1(10.15,46.76)
  vias: v1(1.68,24.4) v1(1.68,23.76) v1(2.48,24.4) v1(2.49,23.76) v1(3.25,24.4) v1(3.25,23.76) v1(11.44,54.25) v1(11.44,52.76) v1(30.93,54.75) v1(31.58,54.75) v1(33.66,51.02) v1(38.46,23.51)
DCDC2: length 9.1
  Top Layer w0.254: L2.2 6.07,18.31 6.56,17.82 8.81,17.82 9.14,18.15 9.14,20.79 9.91,21.56 10.95,21.56 10.96,21.57
DCDC3: length 7.3
  Top Layer w0.254: 20.79,18.58 20.41,18.2 18.08,18.2 17.72,18.57 17.72,20.36 16.93,21.15 U34.4
DCDC4: length 7.4
  Top Layer w0.254: U34.9 16.37,23.15 16.88,23.66 16.88,24.55 17.78,25.44 20.41,25.44 20.77,25.08 L4.2
FLASH_CLK: length 15.7
  Top Layer w0.254: 8.07,53.59 8.07,54.93 8.86,55.72 13.67,55.72 16.64,52.75 v1(17.88,52.75)
  Bottom Layer w0.254: U2.53 18.79,53.55 17.99,52.75 v1(17.88,52.75)
FLASH_CS: length 18.4
  Top Layer w0.254: U35.1 10.61,61.86 10.99,62.24 11.5,62.24 11.75,61.99 R55.2 19.16,61.23 19.16,61.22 19.59,61.22 19.59,61.23 v1(20.31,61.23)
  Bottom Layer w0.254: U2.58 21.29,60.25 v1(20.31,61.23)
FLASH_MISO: length 18.7
  Top Layer w0.254: U35.2 9.34,62.12 9.85,62.63 18.49,62.63 v1(19.37,61.74)
  Bottom Layer w0.254: U2.54 19.29,61.65 v1(19.37,61.74)
FLASH_MOSI: length 17.7
  Top Layer w0.254: v1(19.37,53.35) 16.55,53.35 13.82,56.08 7.87,56.08 6.8,55.01 U35.5
  Bottom Layer w0.254: v1(19.37,53.35) 19.79,53.77 U2.55
GBUF: length 35.3
  Top Layer w0.254: v1(8.2,1.92) 7.69,1.41 3.5,1.41 3.15,1.76 CN2.3
  Bottom Layer w0.254: 30.8,11.26 30.8,9.79 30.04,9.03 21.03,9.03 19.37,7.38 19.37,4.46 17.85,2.94 9.21,2.94 v1(8.2,1.92)
GPIO: length 4.9
  Bottom Layer w0.254: R29.2 34.82,14.24 U12.33 33.62,14.26 33.47,14.11 33.47,13.89 33.6,13.76 U12.34
I/O: length 14.6
  Bottom Layer w0.254: 8.6,51.04 8.6,53.79 11.05,56.23 14.5,56.23 15.75,57.48 17.4,57.48 17.78,57.1 17.78,56.08
IM0: length 12.1
  Top Layer w0.254: 35.89,41.6 35.63,41.34 28,41.34 25.91,43.43 25.91,44.53 25.92,44.54
LCD_CS: length 15.4
  Top Layer w0.254: v1(27.2,47.97) 27.91,47.25 lcd1.7
  Bottom Layer w0.254: v1(27.2,47.97) 26.55,48.61 21.19,48.61 19.55,50.26 U2.44
LCD_RD: length 11.8
  Top Layer w0.254: v1(22.3,50.05) 26.14,46.21 26.18,46.21 26.34,46.05 26.34,46 26.41,45.93 lcd1.10
  Bottom Layer w0.254: U2.60 22.3,55.25 v1(22.3,50.05)
LCD_RS: length 11
  Top Layer w0.254: v1(25.31,49.13) 27.41,47.02 lcd1.8
  Bottom Layer w0.254: v1(25.31,49.13) 25.29,49.15 U2.66
LCD_RST: length 15.9
  Top Layer w0.254: v1(23.3,53.35) 20.52,53.35 15.88,48.71 15.88,45.22 lcd1.31
  Bottom Layer w0.254: U2.65 24.79,54.04 24.1,53.35 v1(23.3,53.35)
LCD_WR: length 11.8
  Top Layer w0.254: lcd1.9 26.91,46.16 v1(23.1,49.97)
  Bottom Layer w0.254: U2.61 22.79,50.29 v1(23.1,49.97)
LED_K: length 7.5
  Top Layer w0.254: lcd1.17 22.91,43.81 22.73,43.63 22.43,43.63 ; lcd1.19 21.91,43.63 21.91,43.63 ; 21.91,43.63 22.43,43.63 ; 21.91,43.63 21.66,43.63 21.41,43.87 lcd1.20 ; 22.43,43.63 22.41,43.64 lcd1.18
LINE: length 14.8
  Bottom Layer w0.254: R58.1 16.89,4.26 18.61,5.98 18.61,8.14 23.23,12.76 U12.1
MICN: length 14.5
  Top Layer w0.254: FPC1.4 37.4,12.58 37.28,12.46 37.28,12.33 ; 37.28,12.33 33.6,12.33 32.01,13.92 v1(29.86,13.92) ; 37.28,12.33 37.28,12.21 37.4,12.08 FPC1.3
  Bottom Layer w0.254: v1(29.86,13.92) 29.23,13.92 28.56,13.26 U12.2
MISO: length 50.7
  Top Layer w0.254: CARD2.7 29.54,51.58 R24.1 28.03,51.55 27.5,51.02 26.26,51.02 24.14,53.13 24.14,53.49 20.05,57.59 10.85,57.59 10.72,57.46 v1(10.23,57.46)
  Bottom Layer w0.254: v1(10.23,57.46) 9.74,57.46 9.61,57.59 7.09,57.59 4.98,55.48 4.98,49.46 6.4,48.05 11.6,48.05 12.47,47.18 12.47,43.89 14,42.35 15.69,42.35 U2.28
MOSI: length 48.5
  Top Layer w0.254: 28.01,55.79 27.7,55.79 27.42,55.51 23.3,55.51 20.36,58.46 v1(13.66,58.46) ; 28.01,55.79 28.04,55.82 CARD2.3 ; 28.01,55.79 R26.1
  Bottom Layer w0.254: v1(13.66,58.46) 12.79,58.46 11.28,56.94 9.75,56.94 9.46,57.23 7.24,57.23 5.4,55.4 5.4,49.54 6.55,48.4 11.75,48.4 12.82,47.33 12.82,44.03 14.1,42.76 U2.29
MP3_LEFT: length 46.9
  Top Layer w0.254: C352.1 10.22,12.64 18.69,12.64 21.78,9.55 v1(26.79,9.55)
  Bottom Layer w0.254: v1(26.79,9.55) 27.81,9.55 28.8,10.54 28.8,11.26 ; 28.82,11.89 28.82,12.24 29.99,13.4 32.47,13.4 33.97,11.9 37.04,11.9 38.46,13.32 38.46,21.13 39.58,22.25 41.25,22.25 41.95,22.95 41.95,23.54
MP3_RIGHT: length 23.1
  Top Layer w0.254: C353.1 13.5,12.21 18.48,12.21 v1(22.17,8.52)
  Bottom Layer w0.254: v1(22.17,8.52) 30.67,8.52 32.3,10.15 32.3,11.26
PA1: length 32.2
  Top Layer w0.254: v1(37.95,18.67) 37.95,17.95 37.52,17.52 v1(36.54,17.52)
  Bottom Layer w0.254: U12.28 35.78,16.76 v1(36.54,17.52) ; v1(37.95,18.67) 37.95,33.51 34.49,36.97 28.9,36.97 28.29,37.58 U2.4
PA2: length 32.6
  Bottom Layer w0.254: U2.5 27.79,37.57 28.75,36.62 34.34,36.62 37.43,33.52 37.43,17.18 36.01,15.76 U12.30
PA3: length 32
  Bottom Layer w0.254: U2.6 27.29,37.57 28.6,36.26 34.19,36.26 37.08,33.37 37.08,17.33 36,16.26 U12.29
PA4: length 29.5
  Bottom Layer w0.254: U12.23 32.8,20.68 33.34,21.22 35,21.22 36.72,22.95 36.72,33.23 34.05,35.9 28.45,35.9 26.79,37.57 U2.7
PA5: length 36.5
  Top Layer w0.254: v1(35.88,27.56) 32.84,24.52 32.84,23 32.07,22.24 v1(32.07,17.92)
  Bottom Layer w0.254: v1(32.07,17.92) 31.69,17.54 28.26,17.54 27.8,18 U12.13 ; v1(35.88,27.56) 35.88,33.57 33.9,35.55 28.31,35.55 26.29,37.57 U2.8
PA6: length 37.9
  Top Layer w0.254: v1(28.65,16.27) 33.58,16.27 35,17.69 v1(35,23.89)
  Bottom Layer w0.254: U12.8 28.63,16.26 v1(28.65,16.27) ; v1(35,23.89) 35,33.95 33.75,35.19 28.16,35.19 25.79,37.56 U2.9
PA7: length 41.5
  Top Layer w0.254: v1(34.48,25.31) 34.48,25.26 35.88,23.86 35.88,15.97 34.69,14.77 v1(29.47,14.77)
  Bottom Layer w0.254: U2.10 25.29,37.56 28.01,34.84 33.6,34.84 34.48,33.96 v1(34.48,25.31) ; U12.3 26.39,13.84 27.09,13.84 28.01,14.77 v1(29.47,14.77)
PB8: length 67.8
  Top Layer w0.254: touch1.4 30.8,23.4 30.8,25.03 31.19,25.41 R2.1 31.19,28.21 31.78,28.81 33.53,28.81 35.14,30.42 35.14,34.79 33.85,36.08 7.18,36.08 5.25,38.01 5.25,46.86 6.86,48.47 12.58,48.47 v1(13.15,47.89)
  Bottom Layer w0.254: v1(13.15,47.89) 13.18,47.87 13.18,46.22 14.17,45.23 15.76,45.23 U2.34
PB9: length 50.3
  Top Layer w0.254: touch1.5 31.3,24.77 31.82,25.29 v1(31.82,25.8)
  Inner1 w0.254: v1(13.92,46.37) 12.9,46.37 12.26,45.73 v1(12.26,40.53)
  Bottom Layer w0.254: v1(12.26,40.53) 12.26,37.48 8.45,33.67 8.45,31.51 9.72,30.24 30.93,30.24 31.82,29.35 v1(31.82,25.8) ; v1(13.92,46.37) 13.92,46.36 14.53,45.76 U2.35
PB15: length 50.7
  Top Layer w0.254: touch1.3 30.31,23.41 v1(30.31,25.41)
  Inner1 w0.254: v1(13.91,48.53) 12.77,48.53 11.63,47.39 v1(11.63,41.42)
  Bottom Layer w0.254: U2.41 14.14,48.76 v1(13.91,48.53) ; v1(11.63,41.42) 11.63,37.35 8.1,33.82 8.1,31.36 9.58,29.88 28.87,29.88 29.66,29.1 29.66,27.45 30.31,26.79 v1(30.31,25.41)
PE0: length 7
  Bottom Layer w0.254: U2.72 28.29,56.63 C4.1 27.12,58.16 27.64,58.67 27.64,60.2 27.12,60.72 27.12,60.72 X2.3
PE1: length 5.5
  Bottom Layer w0.254: U2.73 28.79,56.77 28.39,57.16 C385.1 28.39,58.05 27.99,58.45 27.99,59.45 28.17,59.63 28.72,59.63 X2.1
PE2: length 11.5
  Bottom Layer w0.254: v1(42.23,48.27) 42.23,49.04 41.51,49.76 U2.83
  vias: v1(42.23,47.26)
PE3: length 16.5
  Bottom Layer w0.254: v1(42.11,42.18) 41.85,42.18 41.09,42.94 41.09,48.4 40.24,49.26 U2.84
  vias: v1(42.11,41.29)
PE8: length 66.9
  Top Layer w0.254: touch1.2 29.8,26.16 R1.1 29.79,27.92 31.03,29.16 33.38,29.16 34.79,30.57 34.79,34.64 33.71,35.73 7.03,35.73 4.9,37.86 4.9,47 6.72,48.82 12.43,48.82 12.9,49.29 v1(14.04,49.29)
  Bottom Layer w0.254: v1(14.04,49.29) 15.76,49.29 U2.42
PE11: length 67.2
  Top Layer w0.254: 17.59,6.83 17.6,6.83 17.6,7.72 17.32,8 v1(17.1,8) 16.87,8 16.59,7.72 16.59,6.83
  Inner2 w0.254: 17.11,8.08 17.34,8.31 17.34,20.79 15.48,22.64 15.48,26.76 11.82,30.42 7.61,30.42 7.58,30.45 arc(7.51,30.63) 7.58,30.81 7.8,31.03 arc(7.8,31.39) 7.44,31.39 7.22,31.17 arc(6.86,31.17) 6.86,31.53 7.08,31.75 arc(7.08,32.11) 6.73,32.11 6.5,31.89 arc(6.14,31.89) 6.14,32.25 6.37,32.47 arc(6.37,32.83) 6.01,32.83 5.78,32.61 arc(5.42,32.61) 5.42,32.97 5.65,33.19 arc(5.65,33.55) 5.29,33.55 5.06,33.33 arc(4.89,33.25) 4.71,33.33 4.4,33.63 4.4,46.69 5.87,48.15 12.04,48.15 13.2,49.31 13.2,50.29 13.26,50.35
  Bottom Layer w0.254: v1(13.25,50.36) 13.66,50.77 14.94,50.77
PE12: length 67.2
  Top Layer w0.254: 18.1,6.48 18.1,6.48 18.1,5.98 17.91,5.8 17.3,5.8 17.07,6.03 17.07,6.58
  Inner2 w0.254: 17.59,5.7 17.61,5.68 17.61,5.25 17.33,4.97 16.77,4.97 16.24,5.5 16.24,8.03 16.98,8.77 16.98,20.64 15.12,22.5 15.13,26.55 11.67,30.01 ; 12.3,50.41 12.3,49.37 11.43,48.51 5.72,48.51 4.05,46.83 4.05,33.48 7.5,30.03 11.67,30.03
  Bottom Layer w0.254: 15,51.27 13.18,51.27 v1(12.32,50.41)
  vias: v1(17.62,5.82)
PE13: length 7.7
  Bottom Layer w0.254: U29.7 9.72,51.83 10.1,52.21 12.77,52.21 13.22,51.76 U2.47
PWRON: length 38
  Top Layer w0.254: U34.30 10.91,19.97 10.47,19.97 10,19.5 10,16.29 9.5,15.79 9.5,15.56 8.65,14.71 4,14.71 0.71,18.01 0.71,38.99 U10.2
RST: length 9.1
  Bottom Layer w0.254: U2.100 36.81,41.26 38.04,40.02 v1(38.04,37.73)
  vias: v1(38.76,37.73)
SWCLK: length 33.9
  Top Layer w0.254: v1(40.98,35.68) 36.39,31.09 36.39,22.24 37.15,21.49 39.77,21.49
  Bottom Layer w0.254: U2.98 39.49,42.26 40.98,40.76 v1(40.98,35.68)
SWDIO: length 31.4
  Top Layer w0.254: v1(40.52,34.49) 36.75,30.72 36.75,23.03 37.29,22.49 39.77,22.49
  Bottom Layer w0.254: U2.99 39.1,41.76 40.47,40.39 40.47,34.53 v1(40.52,34.49)
TS: length 3.9
  Top Layer w0.152: R4.1 10.72,15.78 10.72,17.78 11.63,18.69 U34.31
VBACKUP: length 6.7
  Top Layer w0.152: 10.83,21.14 10.01,21.14 9.44,20.57 9.44,17.36 9.07,16.98 7.83,16.98 C14.1
VCAP: length 2.2
  Bottom Layer w0.254: R19.2 33.95,52.76 U2.77
VCAP_1: length 3.2
  Bottom Layer w0.254: R20.2 13.71,52.29 15.75,52.29 U2.48
VRTC: length 7.5
  Top Layer w0.152: C13.1 7.79,15.8 v1(8.56,15.8) 9.08,15.8 9.7,16.42 9.7,20.19 10.26,20.76 10.91,20.76 10.93,20.74
  vias: v1(11.63,50.94)
VSYS: length 1.8
  Top Layer w0.203: v1(12.64,18.14) 12.83,18.33 U34.34
  Top Layer w0.254: v1(12.64,18.14) 12.59,18.14 v1(12.16,17.71)
  vias: v1(8.18,21.93) v1(8.72,22.51) v1(11.99,26.95) v1(12,26.27) v1(14.99,17.41) v1(17.44,22.09) v1(18.15,22.07) v1(18.67,22.4) v1(18.66,21.57) v1(23.06,20.08) v1(23.06,19.46)
$1N8397: length 7
  Bottom Layer w0.254: X1.2 31.18,59.84 31.57,59.45 C384.1 31.57,57.29 31.19,56.91 30.3,56.91 29.79,56.4 U2.75
$1N8398: length 9.8
  Bottom Layer w0.254: U2.76 33.12,53.26 33.73,53.86 33.73,55.89 32.96,56.66 C383.1 32.96,59.58 33.73,60.34 X1.1
$1N8586: length 1.1
  Bottom Layer w0.254: R19.1 34.75,51.58 34.74,51.58
$1N8587: length 0.9
  Bottom Layer w0.254: C36.2 12.15,53.12 R20.1
$1N8688: length 22.7
  Top Layer w0.254: R23.1 28.13,50.32 CARD2.8 29.81,50.43 35.88,50.43 37.03,51.58 37.03,56.91 35.92,58.02 CARD2.1
$1N9003: length 5
  Bottom Layer w0.254: X4.2 9.09,41.17 C378.2 9.09,43.07 9.72,43.7 U29.2
$1N9004: length 5
  Bottom Layer w0.254: X4.1 7.94,41.29 C379.2 7.94,43.07 8.45,43.58 U29.3
$1N19277: length 2
  Top Layer w0.254: 19.09,6.83 19.09,8.75 19.07,8.78
$1N19279: length 2
  Top Layer w0.254: 16.09,6.83 16.09,8.68 16,8.78
$2N7324:
  vias: v1(9.1,23.54)
$3N2174: length 2.7
  Bottom Layer w0.254: R27.1 35.88,18.05 35.59,17.76 U12.26
$3N2188: length 10.4
  Bottom Layer w0.254: 29.8,20.27 29.8,21.08 29.41,21.48 26.61,21.48 25.72,22.37 25.72,25.8 25.6,25.92 25.6,25.94 25.44,26.1 25.42,26.1 24.67,26.85 X3.1
$3N2200: length 1.6
  Bottom Layer w0.254: 29.8,11.26 29.79,11.25 C348.1
$3N2241: length 2
  Bottom Layer w0.254: U23.4 41.85,31.23 42.27,31.65 R36.2
$3N2242: length 10.4
  Bottom Layer w0.254: 40.74,32.16 40.74,31.91 41.2,31.45 U23.3 41.2,29.58 40.71,29.1 39.44,29.1 38.55,28.21 38.55,25.16 39.19,24.53 R35.2
$3N2243: length 0.9
  Bottom Layer w0.355: C359.2 R36.1
$3N2244: length 1.2
  Bottom Layer w0.254: R35.1 40.46,24.4 41.22,23.64
$3N2251: length 2.1
  Bottom Layer w0.254: C360.1 40.55,31.47 U23.2
$3N2275: length 7.8
  Bottom Layer w0.254: 30.3,20.27 30.3,20.27 30.3,21.1 29.53,21.86 27.25,21.86 26.82,22.28 X3.3
$3N2311: length 4.7
  Bottom Layer w0.355: R37.1 C360.2
  Bottom Layer w0.406: R37.1 39.09,34.21 39.45,34.57 39.45,36.72
$3N5130:
  vias: v1(40.67,28.48) v1(40.66,27.83)
$3N5134:
  vias: v1(38.56,31.06) v1(39.27,31.06) v1(39.26,26.69) v1(39.31,25.41) v1(39.39,26.07)
$3N6131:
  vias: v1(12.14,3.57) v1(12.64,3.95) v1(13.25,3.57)
$3N6419: length 1.2
  Bottom Layer w0.457: R58.2 14.93,3.69 C401.1

## Copper pours and planes (outline as drawn; the poured copper is in the pictures)
GND on Top Layer: -2.34,67.71 47.19,67.71 47.19,-3.03 -2.34,-3.03
GND on Top Layer: 22.57,20.74 20.15,20.74 20.15,23 22.57,23
GND on Top Layer: 14.78,27.34 12.69,27.34 12.69,29.24 14.78,29.24
GND on Top Layer: 6.69,20.53 4.26,20.53 4.26,22.9 6.69,22.9
GND on Top Layer: 9.48,25.7 7.33,25.7 7.33,26.7 9.48,26.7 9.48,26.71
GND on Top Layer: 16.85,12.87 14.6,12.87 14.6,15.77 16.85,15.77
GND on Bottom Layer: -0.44,65.67 45.92,65.67 45.92,-0.24 -0.44,-0.24
GND on Inner2: -4.12,68.85 48.46,68.85 48.46,-4.68 -4.12,-4.68
VBAT on Top Layer: 12.6,19.67 12.28,19.67 12.28,18.96 10.88,17.57 10.88,16.17 12.28,16.17 12.28,17.06 11.9,17.44 11.9,17.82 12.6,18.53
VBAT on Top Layer: 17.47,16.14 17.47,14.37 19.25,14.37 19.25,16.14
VBAT on Bottom Layer: 19.25,16.14 19.25,14.62 12.52,14.62 10.48,16.65 10.48,18.43 11.88,18.43 11.88,17.54 13.28,16.14
VBAT on Inner1: 17.46,16.09 17.46,14.91 22.42,9.96 37.06,9.96 42.54,15.44 42.54,26 40.98,27.57 39.61,27.57 39.44,27.39 39.44,27.03 39.67,26.8 41.04,26.8 42.14,25.7 42.14,15.88 37.26,11 22.22,11 19.21,14.01 19.21,16.1 17.47,16.1
VBUS on Top Layer: 14.64,7.62 14.64,5.82 15.89,4.57 18.65,4.57 20.05,5.97 20.05,7.61 20.05,7.62 19.44,7.62 19.43,7.61 19.43,6.24 18.69,5.5 16.05,5.5 15.24,6.31 15.24,7.6 15.25,7.6 14.66,7.6
VBUS on Top Layer: 13.88,19.73 14.18,19.73 14.18,18.95 14.65,18.48 15.81,18.48 16.85,17.44 16.85,16.3 15.84,16.3 15.84,17.19 15.2,17.82 14.82,17.82 13.88,18.76
VBUS on Top Layer: 14.63,6.29 15.23,6.29 15.23,6.3 15.23,9.85 16.17,10.79 16.17,11.65 16.02,11.8 14.82,11.8 14.61,11.59 14.61,6.31
VBUS on Inner2: 14.59,17.62 14.59,9.7 14.96,9.33 15.56,9.31 16.68,10.52 16.61,17.85 16.27,18.19 15.15,18.19
ALDO1 on Top Layer: 12.53,23.79 12.53,25.19 11.26,26.46 11.26,28.11 10.36,28.11 10.36,26.98 12.28,25.06 12.28,23.79
ALDO1 on Top Layer: 11.27,27.31 11.27,28.42 11.11,28.58 10.36,28.58 10.26,28.68 10.26,29.54 8.72,29.54 8.72,28.21 9.65,28.21 10.35,27.51 10.35,27.32 10.35,27.31
ALDO1 on Inner1: 8.73,28.3 8.83,28.2 9.66,28.2 10.09,27.77 17.37,27.77 23.95,21.18 23.95,14.05 24.67,13.34 32.44,13.34 33.85,14.75 33.85,18.22 33.02,18.22 32.64,17.83 32.64,16.29 31.78,15.44 27.37,15.44 26.15,16.66 26.15,20.61 17.25,29.51 8.73,29.51
ALDO2 on Top Layer: 12.2,25.01 10.12,27.09 10.12,27.6 9.61,28.11 8.47,28.11 8.47,27.22 9.36,27.22 11.9,24.68 11.9,23.79 12.2,23.79
ALDO3 on Top Layer: 13.42,23.79 13.04,23.79 13.04,25.44 12.66,25.82 12.66,26.84 13.68,26.84 13.68,25.7 13.42,25.44
ALDO3 on Inner1: 12.91,25.4 13.11,25.2 13.51,25.2 13.66,25.35 13.66,25.76 13.98,26.08 16.5,26.08 20.89,21.69 20.89,14.3 23.66,11.53 30.73,11.53 31.02,11.81 31.02,12.52 30.61,12.93 24.6,12.93 21.86,15.66 21.86,22.79 17.42,27.23 13.72,27.23 12.91,26.43
ALDO4 on Top Layer: 13.47,25.36 13.74,25.63 13.74,26.84 14.82,26.84 14.82,25.95 13.8,24.93 13.8,23.79 13.47,23.79
BLDO1 on Top Layer: 14.62,23.82 14.62,24.69 15.86,25.92 16.36,25.92 17.27,26.83 18.1,26.83 18.33,27.06 18.33,27.2 19.39,28.26 19.44,28.26 20.03,27.67 20.03,27.63 18.62,26.21 17.47,26.21 16.82,25.57 15.93,25.57 15,24.64 15,23.82
BLDO2 on Top Layer: 13.93,23.79 13.93,24.96 14.95,25.97 14.95,29.25 15.83,29.25 15.83,26.38 14.18,24.73 14.18,23.79
BLDOIN on Top Layer: 15.91,27.98 16.82,27.98 16.82,26.43 16.34,25.95 15.84,25.95 14.56,24.68 14.56,23.79 14.29,23.79 14.29,24.78 15.91,26.4
CHGLED on Top Layer: 22.99,17.87 22.99,16.55 21.75,16.55 21.75,17.87
CHGLED on Top Layer: 16.37,18.6 15.52,18.6 15.52,20.07 16.37,20.07
CHGLED on Bottom Layer: 15.56,19.83 15.56,18.68 17.6,16.65 22.93,16.65 22.93,17.24 22.89,17.29 18.1,17.29 16.33,19.06 16.33,19.83
CPUS_LDO on Top Layer: 15.49,23.43 16.29,23.43 16.29,23.42 16.7,23.82 16.7,24.75 16.43,25.01 16.1,25.01 15.49,24.4
CPUS_LDO on Top Layer: 21.73,27.79 20.99,27.05 20.99,27.04 19.55,28.48 20.31,29.24 20.31,29.24 21.73,27.82
CPUS_LDO on Bottom Layer: 15.93,23.68 15.93,24.84 20.28,29.19 20.36,29.19 21.03,28.52 21.03,28.36 16.28,23.62 15.93,23.62 15.93,23.68
DC1SW on Top Layer: 11.77,23.79 11.77,24.69 11.28,25.19 11.26,25.19 10.63,25.82 9.65,25.82 9.65,24.58 10.44,23.79
DC1SW on Top Layer: 6.94,25.7 6.94,26.71 7.2,26.97 8.21,26.97 8.21,28.08 6.28,28.08 5.93,27.73 5.93,25.7
DC1SW on Bottom Layer: 11.37,23.82 10.5,23.81 10.41,23.8 7.56,26.68 6.41,26.68 5.99,27.09 5.99,27.73 6.32,28.05 8.42,28.05 11.39,25.07
DC4SW on Top Layer: 19.57,25.66 20.82,26.91 20.21,27.52 20.21,27.52 18.83,26.15 17.5,26.15 16.86,25.51 15.97,25.51 15.07,24.61 15.07,23.82 15.07,23.82 15.37,23.82 15.39,23.84 15.39,24.43 16.12,25.16 17.14,25.16 17.64,25.66
DCDC1 on Top Layer: 9,54.65 11.81,54.65 11.81,52.38 9,52.38
DCDC1 on Top Layer: 6.69,24.8 6.69,23 1.18,23 1.18,24.78 6.67,24.78
DCDC1 on Top Layer: 27.79,53.7 28.45,53.7 28.65,53.89 28.65,54.12 28.9,54.37 31.95,54.37 31.95,55.24 27.79,55.24
DCDC1 on Top Layer: 37.08,23.79 40.58,23.79 40.58,23.13 37.08,23.13
DCDC1 on Top Layer: 6.69,23.03 4.28,23.03 4.28,24.81 6.69,24.81
DCDC1 on Top Layer: 30.17,27.45 30.8,27.45 30.8,25.82 30.17,25.82
DCDC1 on Inner1: -1.2,66.05 46.43,66.05 46.43,-0.62 -1.2,-0.62
DCDC2 on Top Layer: 6.82,18.2 4.25,18.2 4.25,20.18 6.82,20.18
DCDC3 on Top Layer: 22.57,18.46 20.15,18.46 20.15,20.36 22.57,20.36
DCDC4 on Top Layer: 22.57,23.28 20.15,23.28 20.15,25.06 22.57,25.06
DCDC5/VSYS on Top Layer: 14.44,12.87 12.41,12.87 12.41,15.66 14.44,15.66
IM0 on Top Layer: 35.51,42.94 36.14,42.94 36.14,41.16 35.51,41.16
LED_K on Top Layer: 22.17,43.7 23.06,42.81 23.95,42.81 24.96,41.8 24.96,40.65 25.85,39.77 36.39,39.77 36.39,40.87 26.61,40.87 25.98,41.51 25.98,41.88 24.16,43.7
LEFT on Top Layer: 4.77,14.49 4.77,10.94 4.52,10.68 2.1,10.68 1.85,10.43 1.85,8.9 1.98,8.78 4.39,8.78 6.67,11.06 6.67,14.49
PE2 on Top Layer: 44.11,46.76 44.11,45.84 44.05,45.78 42.39,45.78 41.93,46.24 41.93,48.44 42.05,48.56 42.45,48.56 42.67,48.33 42.67,47.01 42.81,46.87 44,46.87
PE2 on Bottom Layer: 43.14,48.7 42.05,48.7 41.96,48.62 41.96,47 42.14,46.83 43.14,46.83 43.14,46.83
PE3 on Top Layer: 44.04,40.63 44.04,39.67 44.01,39.64 42.08,39.64 41.75,39.97 41.75,42.48 41.76,42.49 42.32,42.49 42.36,42.44 42.36,40.76 43.9,40.76 43.94,40.72 43.95,40.72
PE3 on Bottom Layer: 43.11,42.48 41.86,42.48 41.85,42.47 41.85,40.85 41.82,40.83 43.08,40.83 43.11,40.85
RIGHT on Top Layer: 13.48,9.04 11.12,9.04 9.21,7.13 9.21,4.71 11.7,4.71 11.7,6.69 12.14,7.13 13.48,7.13
RST on Top Layer: 36.81,36.23 36.81,37.87 37.65,37.87 38.04,38.26 38.04,39.15 39.56,39.15 39.56,38.02 37.78,36.23
VRTC on Top Layer: 8.97,16.27 7.31,16.27 7.31,15.32 8.97,15.32
VRTC on Bottom Layer: 11.88,51.45 10.74,51.45 10.74,50.48 11.88,50.48 11.88,51.45
VRTC on Inner1: 8.19,15.41 8.86,15.41 8.99,15.54 8.99,16.28 5.14,20.14 5.14,47.35 7.86,50.08 11.47,50.08 12.2,50.81 12.2,51.65 12.03,51.83 7.61,51.83 3.94,48.15 3.94,19.66
VSYS on Top Layer: 11.34,22.9 6.82,22.9 6.82,20.49 7.96,20.49 8.34,20.87 8.34,21.6 9.01,22.27 11.34,22.27
VSYS on Top Layer: 13,23.83 13,25.42 12.53,25.88 12.53,28.11 11.39,28.11 11.39,26.41 12.62,25.18 12.62,23.83
VSYS on Top Layer: 13.48,19.73 13.82,19.73 13.82,18.69 14.82,17.69 15.2,17.69 15.58,17.31 15.58,16.3 14.56,16.3 14.56,17.45 13.48,18.53
VSYS on Top Layer: 19.9,20.74 18.88,20.74 17.87,21.76 15.47,21.76 15.47,22.48 17.96,22.48 18.37,22.9 19.9,22.9
VSYS on Bottom Layer: 19.63,19.19 20.47,20.39 20.52,20.33 23.31,20.33 23.31,19.19
VSYS on Bottom Layer: 19.25,21.6 20.47,20.39 21.41,21.73 19.25,22.24
VSYS on Bottom Layer: 19.25,22.75 19.25,22.24 17.09,22.75
VSYS on Inner1: 16.33,21.85 16.8,22.55 18.44,22.93 19.34,22.6 19.25,19.43 16.79,15.77 10.43,15.77 6.53,19.66 6.53,24.11 10.14,27.71 12.77,27.71 12.77,25.57 10.88,23.68 10.88,20.13 11.81,19.2 14.54,19.2 15.76,20.42
$1N13562 on Top Layer: 36.9,40.91 38.42,40.91 39.31,41.8 39.31,44.34 40.58,44.34 40.58,40.91 39.57,39.89 36.9,39.89
$1N13566 on Top Layer: 36.27,46.12 36.27,43.43 36.61,43.43 37.59,44.41 38.58,44.41 38.58,45.35 37.59,45.35 36.83,46.12
$2N1132 on Top Layer: 23.31,18.06 23.62,18.36 23.62,19.13 24.03,19.13 24.03,17.24 23.31,17.24
$2N7324 on Top Layer: 11.34,23.03 11.34,23.28 10.16,23.28 8.85,24.59 8.85,24.81 7.2,24.81 7.2,23.03
$2N7333 on Top Layer: 9.7,21.76 8.92,20.97 8.92,18.27 8.85,18.2 7.27,18.2 7.27,20.23 8.09,20.23 8.44,20.59 8.44,21.6 8.98,22.14 11.34,22.14 11.34,21.76
$2N7338 on Top Layer: 15.45,21.7 17.67,21.7 19.01,20.36 19.38,20.36 19.38,18.58 17.9,18.58 17.9,20.58 17.1,21.38 15.45,21.38
$2N7343 on Top Layer: 16.55,22.92 17.31,23.68 17.31,24.58 17.79,25.06 19.39,25.06 19.39,23.28 18.59,23.28 17.89,22.57 15.49,22.57 15.49,22.92
$2N7384 on Top Layer: 13.42,19.73 13.04,19.73 13.04,18.07 12.53,17.57 12.53,16.3 14.31,16.3 14.31,17.57 13.42,18.46
$2N7386 on Top Layer: 15.45,20.54 17.11,20.54 17.44,20.21 17.44,18.54 18.03,17.95 20.02,17.95 20.02,16.84 19.49,16.85 18.95,16.85 18.28,16.85 16.62,18.51 16.62,19.84 16.26,20.2 15.45,20.2
$3N5130 on Top Layer: 39.01,29.12 39.99,29.12 40.22,28.89 40.22,27.5 40.92,27.5 41.24,27.82 41.24,29.73 41.12,29.85 39.01,29.85
$3N5130 on Bottom Layer: 42.08,25.32 41.95,25.19 41.73,25.19 41.6,25.32 41.6,27.07 41.15,27.51 40.5,27.51 40.23,27.78 40.23,28.6 40.43,28.8 41.39,28.8 42.07,28.12 42.07,25.33
$3N5134 on Top Layer: 40.84,30.11 40.84,31.38 37.86,31.38 37.08,30.6 37.08,25.74 37.66,25.16 39.69,25.16 39.69,26.81 39.44,27.07 38.3,27.07 38.04,27.32 38.04,29.73 38.42,30.11
$3N5134 on Bottom Layer: 38.93,26.94 40.08,26.94 40.08,25.16 38.93,25.16
$3N6131 on Top Layer: 9.21,4.21 14.17,4.21 14.17,3.18 12.64,3.18 11.75,2.3 11.75,1.9 9.21,1.9
$3N6131 on Bottom Layer: 11.88,4.21 14.2,4.21 14.2,3.22 11.88,3.22

Small or netless copper shapes (teardrops, artwork), in the pictures only: 134 on Top Layer, 309 on Bottom Layer, 5 on Inner1, 3 on Inner2

## Text on the board
Bottom Silkscreen Layer: [荒坂産業] | Arasaka Industry
Top Solder Mask Layer: [Topaz] / ver1.2 | @EK_Industry
